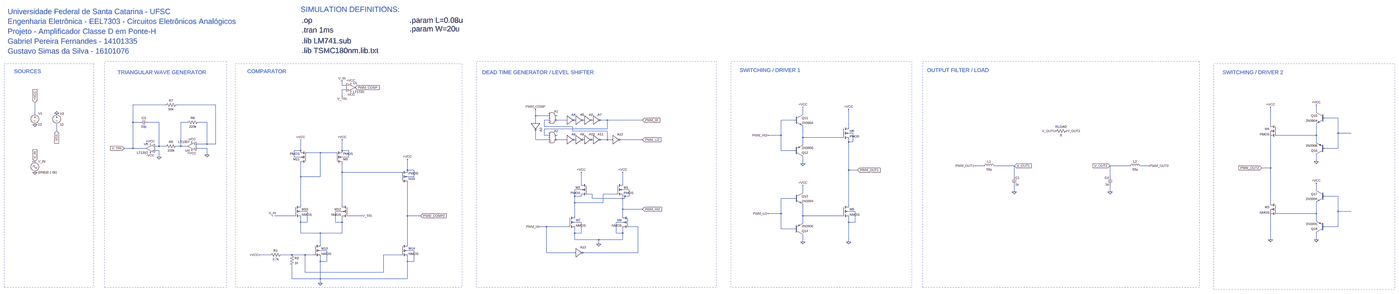
[diagram p0: schematic AmplificadorClasseD-V1.asc, whole sheet]
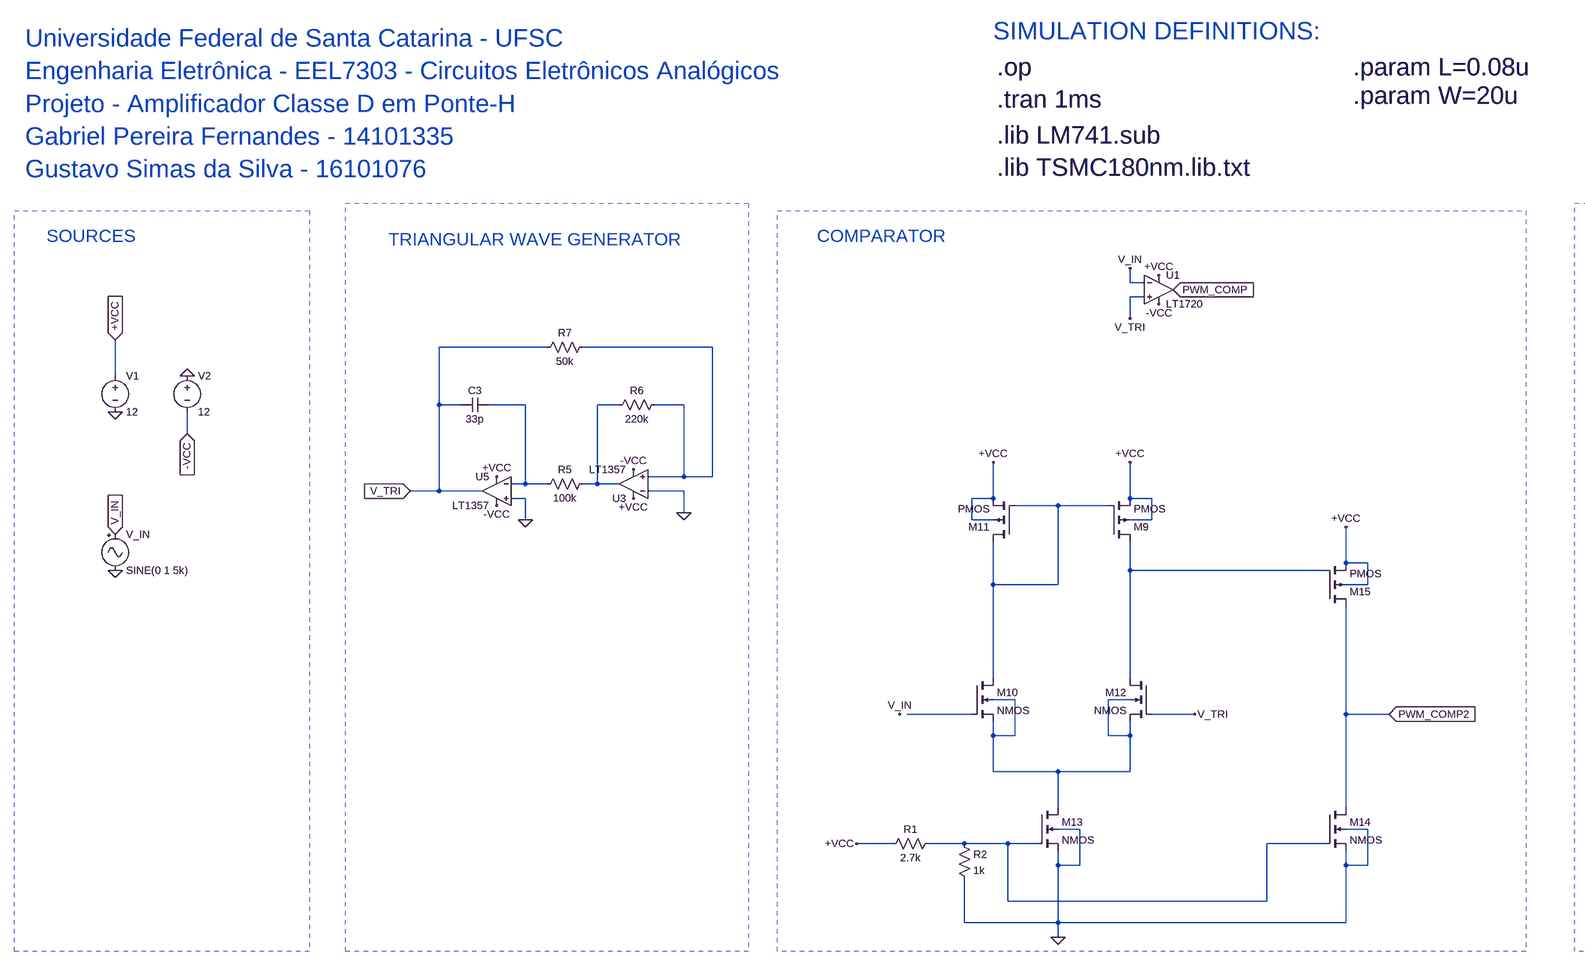
[diagram p1: schematic AmplificadorClasseD-V1.asc, part, row 1 of 1, column 1 of 3]
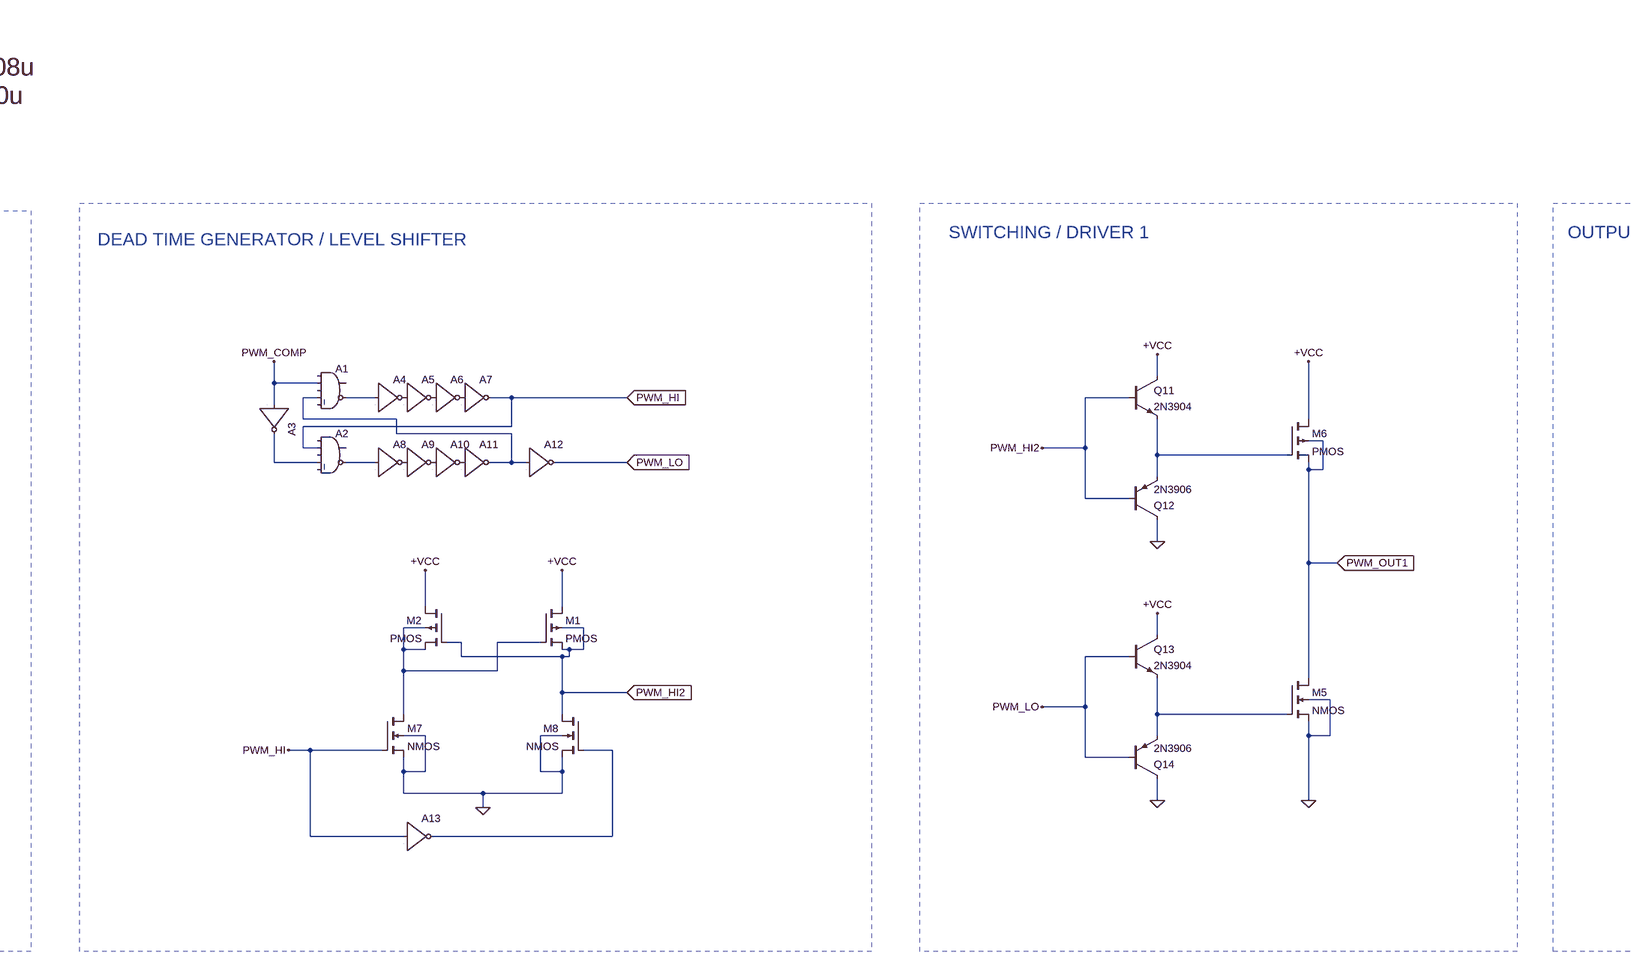
[diagram p2: schematic AmplificadorClasseD-V1.asc, part, row 1 of 1, column 2 of 3]
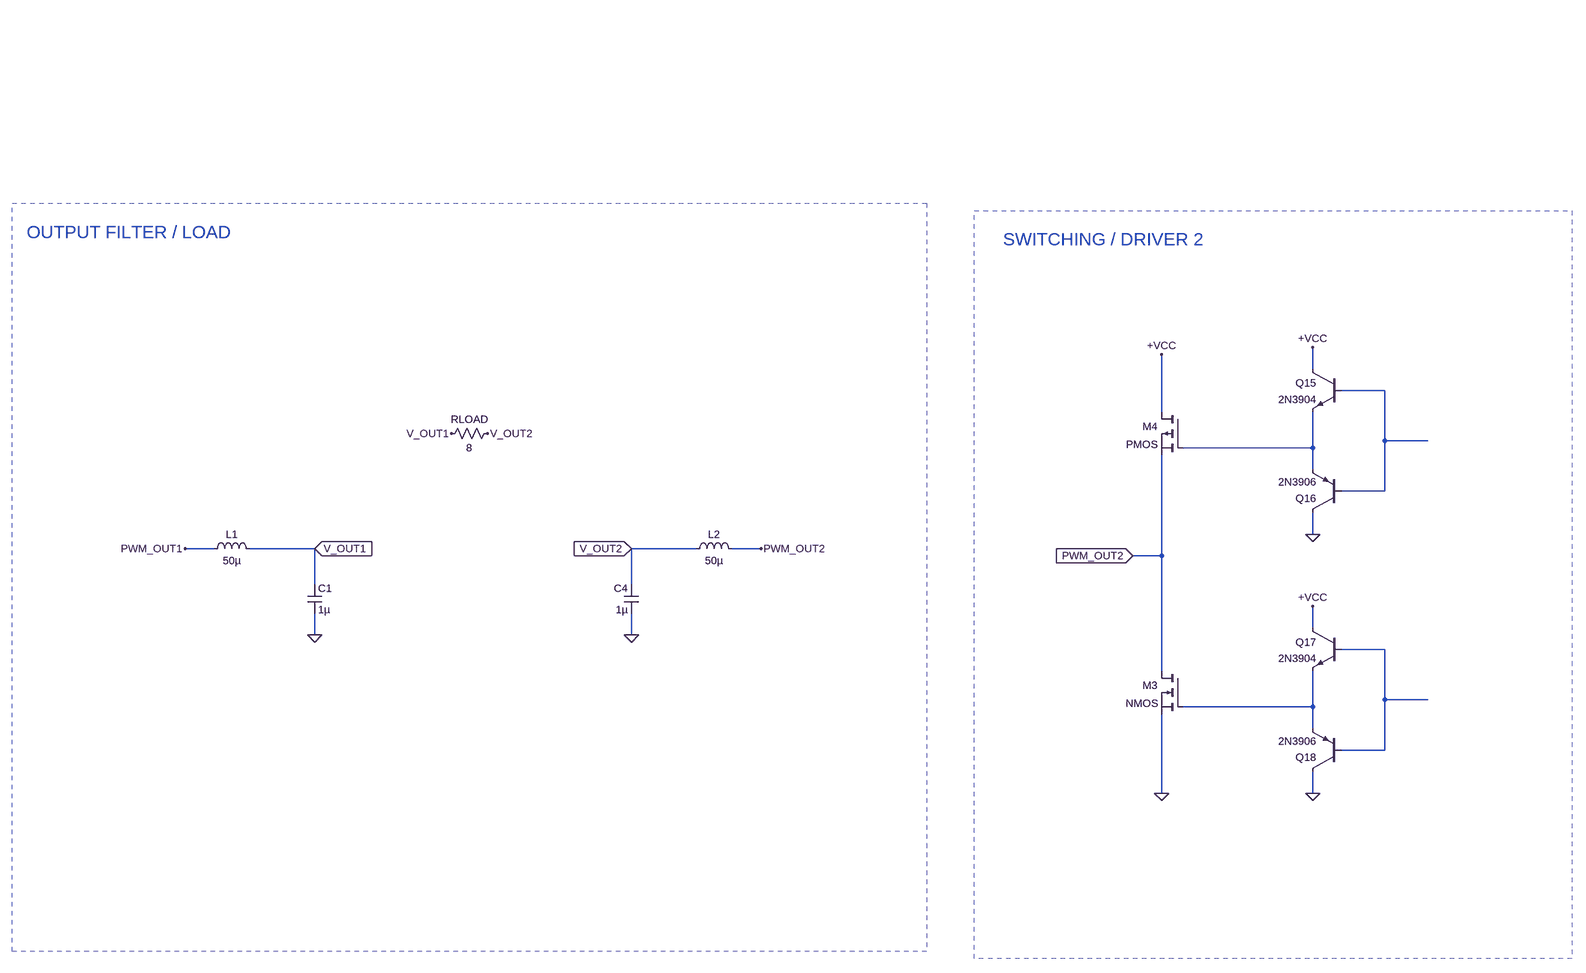
[diagram p3: schematic AmplificadorClasseD-V1.asc, part, row 1 of 1, column 3 of 3]
AmplificadorClasseD-V1.asc, the LTspice schematic file:
Version 4
SHEET 1 8820 948
WIRE 1056 -560 1056 -592
WIRE 1088 -560 1056 -560
WIRE 1088 -528 1056 -528
WIRE 1056 -480 1056 -528
WIRE -240 -416 -480 -416
WIRE 128 -416 -160 -416
WIRE 8240 -368 8240 -416
WIRE -1200 -352 -1200 -432
WIRE 4448 -352 4448 -400
WIRE 2480 -336 2480 -384
WIRE 2576 -336 2480 -336
WIRE 8400 -320 8304 -320
WIRE 2576 -304 2544 -304
WIRE 2704 -304 2640 -304
WIRE 3008 -304 2960 -304
WIRE 3264 -304 3008 -304
WIRE 4384 -304 4288 -304
WIRE -480 -288 -480 -416
WIRE -432 -288 -480 -288
WIRE -288 -288 -368 -288
WIRE -80 -288 -128 -288
WIRE 64 -288 0 -288
WIRE 2480 -288 2480 -336
WIRE 7904 -272 7904 -400
WIRE 2544 -256 2544 -304
WIRE 2752 -256 2544 -256
WIRE 4784 -256 4784 -384
WIRE 3008 -240 3008 -304
WIRE 3008 -240 2544 -240
WIRE -1040 -224 -1040 -272
WIRE 2752 -224 2752 -256
WIRE 3008 -224 2752 -224
WIRE 4816 -208 4784 -208
WIRE 8400 -208 8400 -320
WIRE 8496 -208 8400 -208
WIRE 2544 -192 2544 -240
WIRE 2576 -192 2544 -192
WIRE 4288 -192 4288 -304
WIRE 4288 -192 4192 -192
WIRE 8240 -192 8240 -272
WIRE 8240 -192 7952 -192
WIRE 4448 -176 4448 -256
WIRE 4736 -176 4448 -176
WIRE 2480 -160 2480 -224
WIRE 2576 -160 2480 -160
WIRE 2704 -160 2640 -160
WIRE 3008 -160 3008 -224
WIRE 3008 -160 2960 -160
WIRE 3040 -160 3008 -160
WIRE 3264 -160 3104 -160
WIRE 4784 -144 4784 -160
WIRE 4816 -144 4816 -208
WIRE 4816 -144 4784 -144
WIRE 8240 -144 8240 -192
WIRE 64 -128 64 -288
WIRE 64 -128 -16 -128
WIRE 128 -128 128 -416
WIRE 128 -128 64 -128
WIRE 4448 -128 4448 -176
WIRE -288 -112 -288 -288
WIRE -288 -112 -320 -112
WIRE -240 -112 -288 -112
WIRE -128 -112 -128 -288
WIRE -128 -112 -160 -112
WIRE -80 -112 -128 -112
WIRE -480 -96 -480 -288
WIRE -480 -96 -544 -96
WIRE -384 -96 -480 -96
WIRE 64 -96 -16 -96
WIRE 8400 -96 8400 -208
WIRE 8400 -96 8304 -96
WIRE -288 -80 -320 -80
WIRE 752 -80 752 -160
WIRE 752 -80 704 -80
WIRE 1056 -80 1056 -160
WIRE 1104 -80 1056 -80
WIRE 4288 -80 4288 -192
WIRE 4384 -80 4288 -80
WIRE 896 -64 800 -64
WIRE 1008 -64 896 -64
WIRE 64 -48 64 -96
WIRE -288 -32 -288 -80
WIRE 704 -32 704 -80
WIRE 752 -32 704 -32
WIRE 1104 -32 1104 -80
WIRE 1104 -32 1056 -32
WIRE 8240 0 8240 -48
WIRE 4448 16 4448 -32
WIRE 5776 32 5712 32
WIRE 6000 32 5856 32
WIRE 6848 32 6704 32
WIRE 6992 32 6928 32
WIRE 7904 48 7904 -176
WIRE 7904 48 7840 48
WIRE 1536 64 1536 -16
WIRE 1584 64 1536 64
WIRE 4784 64 4784 -144
WIRE 4848 64 4784 64
WIRE 1056 80 1056 16
WIRE 1488 80 1056 80
WIRE 752 112 752 16
WIRE 896 112 896 -64
WIRE 896 112 752 112
WIRE 1584 112 1584 64
WIRE 1584 112 1536 112
WIRE 6000 112 6000 32
WIRE 6704 112 6704 32
WIRE 2816 160 2816 80
WIRE 3120 160 3120 80
WIRE 2816 208 2768 208
WIRE 3168 208 3120 208
WIRE 8240 208 8240 160
WIRE 4448 224 4448 176
WIRE 6000 224 6000 176
WIRE 6704 224 6704 176
WIRE 2896 240 2864 240
WIRE 3072 240 2976 240
WIRE 2768 256 2768 208
WIRE 2816 256 2768 256
WIRE 3136 256 3120 256
WIRE 3168 256 3168 208
WIRE 3168 256 3136 256
WIRE 8400 256 8304 256
WIRE 2896 272 2896 240
WIRE 3120 272 2896 272
WIRE 3136 272 3136 256
WIRE 3136 272 3120 272
WIRE 4384 272 4288 272
WIRE 2768 304 2768 256
WIRE 2976 304 2976 240
WIRE 2976 304 2768 304
WIRE 7904 304 7904 48
WIRE 752 320 752 112
WIRE 1056 320 1056 80
WIRE 4784 320 4784 64
WIRE 3120 352 3120 272
WIRE 3264 352 3120 352
WIRE 800 368 752 368
WIRE 1056 368 1008 368
WIRE 4832 368 4784 368
WIRE 8400 368 8400 256
WIRE 8496 368 8400 368
WIRE 4288 384 4288 272
WIRE 4288 384 4192 384
WIRE 8240 384 8240 304
WIRE 8240 384 7952 384
WIRE 704 400 560 400
WIRE 1200 400 1104 400
WIRE 1536 400 1536 160
WIRE 1632 400 1536 400
WIRE 2768 400 2768 304
WIRE 3120 400 3120 352
WIRE 4448 400 4448 320
WIRE 4736 400 4448 400
WIRE 8240 432 8240 384
WIRE 752 448 752 416
WIRE 800 448 800 368
WIRE 800 448 752 448
WIRE 1008 448 1008 368
WIRE 1056 448 1056 416
WIRE 1056 448 1008 448
WIRE 2816 448 2768 448
WIRE 3120 448 3072 448
WIRE 4448 448 4448 400
WIRE 4784 448 4784 416
WIRE 4832 448 4832 368
WIRE 4832 448 4784 448
WIRE 2560 480 2512 480
WIRE 2720 480 2560 480
WIRE 3232 480 3168 480
WIRE 8400 480 8400 368
WIRE 8400 480 8304 480
WIRE 4288 496 4288 384
WIRE 4384 496 4288 496
WIRE 752 528 752 448
WIRE 896 528 752 528
WIRE 1056 528 1056 448
WIRE 1056 528 896 528
WIRE 2768 528 2768 496
WIRE 2816 528 2816 448
WIRE 2816 528 2768 528
WIRE 3072 528 3072 448
WIRE 3120 528 3120 496
WIRE 3120 528 3072 528
WIRE 2768 576 2768 528
WIRE 2944 576 2768 576
WIRE 3120 576 3120 528
WIRE 3120 576 2944 576
WIRE 7904 576 7904 400
WIRE 8240 576 8240 528
WIRE 4448 592 4448 544
WIRE 4784 592 4784 448
WIRE 896 608 896 528
WIRE 1536 608 1536 400
WIRE 2944 608 2944 576
WIRE 944 656 896 656
WIRE 1584 656 1536 656
WIRE 2560 672 2560 480
WIRE 2768 672 2560 672
WIRE 3232 672 3232 480
WIRE 3232 672 2832 672
WIRE 528 688 448 688
WIRE 688 688 608 688
WIRE 784 688 688 688
WIRE 848 688 784 688
WIRE 1488 688 1360 688
WIRE 896 736 896 704
WIRE 944 736 944 656
WIRE 944 736 896 736
WIRE 1536 736 1536 704
WIRE 1584 736 1584 656
WIRE 1584 736 1536 736
WIRE 784 816 784 688
WIRE 1360 816 1360 688
WIRE 1360 816 784 816
WIRE 688 864 688 768
WIRE 896 864 896 736
WIRE 896 864 688 864
WIRE 1536 864 1536 736
WIRE 1536 864 896 864
WIRE 896 896 896 864
FLAG -1200 -272 0
FLAG -1200 -432 +VCC
IOPIN -1200 -432 In
FLAG -1040 -352 0
FLAG -1040 -224 -VCC
IOPIN -1040 -224 In
FLAG -1200 80 0
FLAG -1200 0 V_IN
IOPIN -1200 0 In
FLAG 1152 -544 PWM_COMP
IOPIN 1152 -544 In
FLAG -352 -128 +VCC
FLAG -352 -64 -VCC
FLAG -288 -32 0
FLAG -48 -80 +VCC
FLAG -48 -144 -VCC
FLAG 64 -48 0
FLAG -544 -96 V_TRI
IOPIN -544 -96 In
FLAG 4784 -384 +VCC
FLAG 4448 -400 +VCC
FLAG 4448 16 0
FLAG 4784 592 0
FLAG 4448 176 +VCC
FLAG 4448 592 0
FLAG 6000 224 0
FLAG 6000 32 V_OUT1
IOPIN 6000 32 In
FLAG 4848 64 PWM_OUT1
IOPIN 4848 64 In
FLAG 5712 32 PWM_OUT1
FLAG 6704 224 0
FLAG 6704 32 V_OUT2
IOPIN 6704 32 In
FLAG 6992 32 PWM_OUT2
FLAG 7904 -400 +VCC
FLAG 8240 -416 +VCC
FLAG 8240 0 0
FLAG 7904 576 0
FLAG 8240 160 +VCC
FLAG 8240 576 0
FLAG 7840 48 PWM_OUT2
IOPIN 7840 48 In
FLAG 2480 -384 PWM_COMP
FLAG 2512 480 PWM_HI
FLAG 3264 -304 PWM_HI
IOPIN 3264 -304 In
FLAG 3264 -160 PWM_LO
IOPIN 3264 -160 In
FLAG 3264 352 PWM_HI2
IOPIN 3264 352 In
FLAG 4192 -192 PWM_HI2
FLAG 4192 384 PWM_LO
FLAG 6304 -224 V_OUT1
FLAG 6384 -224 V_OUT2
FLAG 1120 -576 +VCC
FLAG 544 400 V_IN
FLAG 1200 400 V_TRI
FLAG 2816 80 +VCC
FLAG 3120 80 +VCC
FLAG 2944 608 0
FLAG 1056 -160 +VCC
FLAG 752 -160 +VCC
FLAG 896 896 0
FLAG 1536 -16 +VCC
FLAG 448 688 +VCC
FLAG 1056 -592 V_IN
FLAG 1056 -480 V_TRI
FLAG 1120 -512 -VCC
FLAG 1632 400 PWM_COMP2
IOPIN 1632 400 In
SYMBOL voltage -1200 -368 R0
WINDOW 123 0 0 Left 0
WINDOW 39 0 0 Left 0
SYMATTR InstName V1
SYMATTR Value 12
SYMBOL voltage -1040 -368 R0
WINDOW 123 0 0 Left 0
WINDOW 39 0 0 Left 0
SYMATTR InstName V2
SYMATTR Value 12
SYMBOL Misc\\signal -1200 -16 R0
WINDOW 123 0 0 Left 0
WINDOW 39 0 0 Left 0
SYMATTR InstName V_IN
SYMATTR Value SINE(0 1 5k)
SYMBOL Opamps\\LT1357 -352 -160 M0
SYMATTR InstName U5
SYMBOL res -144 -128 R90
WINDOW 0 0 56 VBottom 2
WINDOW 3 32 56 VTop 2
SYMATTR InstName R5
SYMATTR Value 100k
SYMBOL Opamps\\LT1357 -48 -48 R180
SYMATTR InstName U3
SYMBOL cap -368 -304 R90
WINDOW 0 0 32 VBottom 2
WINDOW 3 32 32 VTop 2
SYMATTR InstName C3
SYMATTR Value 33p
SYMBOL res 16 -304 R90
WINDOW 0 0 56 VBottom 2
WINDOW 3 32 56 VTop 2
SYMATTR InstName R6
SYMATTR Value 220k
SYMBOL res -144 -432 R90
WINDOW 0 0 56 VBottom 2
WINDOW 3 32 56 VTop 2
SYMATTR InstName R7
SYMATTR Value 50k
SYMBOL npn 4384 -352 R0
SYMATTR InstName Q11
SYMATTR Value 2N3904
SYMBOL pnp 4384 -32 M180
SYMATTR InstName Q12
SYMATTR Value 2N3906
SYMBOL npn 4384 224 R0
SYMATTR InstName Q13
SYMATTR Value 2N3904
SYMBOL pnp 4384 544 M180
SYMATTR InstName Q14
SYMATTR Value 2N3906
SYMBOL ind 5760 48 R270
WINDOW 0 32 56 VTop 2
WINDOW 3 5 56 VBottom 2
SYMATTR InstName L1
SYMATTR Value 50µ
SYMBOL cap 5984 112 R0
SYMATTR InstName C1
SYMATTR Value 1µ
SYMBOL res 6400 -240 R90
WINDOW 0 0 56 VBottom 2
WINDOW 3 32 56 VTop 2
SYMATTR InstName RLOAD
SYMATTR Value 8
SYMBOL ind 6944 48 M270
WINDOW 0 32 56 VTop 2
WINDOW 3 5 56 VBottom 2
SYMATTR InstName L2
SYMATTR Value 50µ
SYMBOL cap 6720 112 M0
SYMATTR InstName C4
SYMATTR Value 1µ
SYMBOL nmos 7952 304 M0
SYMATTR InstName M3
SYMBOL pmos 7952 -272 M0
SYMATTR InstName M4
SYMBOL npn 8304 -368 M0
SYMATTR InstName Q15
SYMATTR Value 2N3904
SYMBOL pnp 8304 -48 R180
SYMATTR InstName Q16
SYMATTR Value 2N3906
SYMBOL npn 8304 208 M0
SYMATTR InstName Q17
SYMATTR Value 2N3904
SYMBOL pnp 8304 528 R180
SYMATTR InstName Q18
SYMATTR Value 2N3906
SYMBOL Digital\\and 2608 -384 R0
SYMATTR InstName A1
SYMBOL Digital\\and 2608 -240 R0
SYMATTR InstName A2
SYMBOL Digital\\inv 2544 -288 R90
SYMATTR InstName A3
SYMBOL Digital\\inv 2704 -368 R0
SYMATTR InstName A4
SYMBOL Digital\\inv 2768 -368 R0
SYMATTR InstName A5
SYMBOL Digital\\inv 2832 -368 R0
SYMATTR InstName A6
SYMBOL Digital\\inv 2896 -368 R0
SYMATTR InstName A7
SYMBOL Digital\\inv 2704 -224 R0
SYMATTR InstName A8
SYMBOL Digital\\inv 2768 -224 R0
SYMATTR InstName A9
SYMBOL Digital\\inv 2832 -224 R0
SYMATTR InstName A10
SYMBOL Digital\\inv 2896 -224 R0
SYMATTR InstName A11
SYMBOL Digital\\inv 3040 -224 R0
SYMATTR InstName A12
SYMBOL nmos4 4736 320 R0
SYMATTR InstName M5
SYMATTR Value2 l=0.9u w=1.8u
SYMBOL pmos4 4736 -256 R0
SYMATTR InstName M6
SYMATTR Value2 l=0.9u w=1.8u
SYMBOL Comparators\\LT1720 1120 -608 R0
SYMATTR InstName U1
SYMBOL pmos4 3072 160 R0
SYMATTR InstName M1
SYMATTR Value2 l={L} w={W}
SYMBOL pmos4 2864 160 M0
SYMATTR InstName M2
SYMATTR Value2 l={L} w={W}
SYMBOL nmos4 2720 400 R0
SYMATTR InstName M7
SYMATTR Value2 l={L} w={W}
SYMBOL nmos4 3168 400 M0
SYMATTR InstName M8
SYMATTR Value2 l={L} w={W}
SYMBOL Digital\\inv 2768 608 R0
SYMATTR InstName A13
SYMBOL pmos4 1008 16 M180
SYMATTR InstName M9
SYMATTR Value2 l={L} w={W}
SYMBOL nmos4 704 320 R0
SYMATTR InstName M10
SYMATTR Value2 l={L} w={W}
SYMBOL pmos4 800 16 R180
SYMATTR InstName M11
SYMATTR Value2 l={L} w={W}
SYMBOL nmos4 1104 320 M0
SYMATTR InstName M12
SYMATTR Value2 l={L} w={W}
SYMBOL nmos4 848 608 R0
SYMATTR InstName M13
SYMATTR Value2 l={L} w={W}
SYMBOL nmos4 1488 608 R0
SYMATTR InstName M14
SYMATTR Value2 l={L} w={W}
SYMBOL pmos4 1488 160 M180
SYMATTR InstName M15
SYMATTR Value2 l={L} w={W}
SYMBOL res 624 672 R90
WINDOW 0 0 56 VBottom 2
WINDOW 3 32 56 VTop 2
SYMATTR InstName R1
SYMATTR Value 2.7k
SYMBOL res 672 672 R0
SYMATTR InstName R2
SYMATTR Value 1k
TEXT 760 -968 Left 5 !.tran 1ms
TEXT 760 -888 Left 5 !.lib LM741.sub
TEXT -1400 -1104 Left 5 ;Universidade Federal de Santa Catarina - UFSC\nEngenharia Eletrônica - EEL7303 - Circuitos Eletrônicos Analógicos\nProjeto - Amplificador Classe D em Ponte-H\nGabriel Pereira Fernandes - 14101335\nGustavo Simas da Silva - 16101076
TEXT 752 -1120 Left 5 ;SIMULATION DEFINITIONS:
TEXT 760 -1040 Left 5 !.op
TEXT -1352 -664 Left 4 ;SOURCES
TEXT -592 -656 Left 4 ;TRIANGULAR WAVE GENERATOR
TEXT 360 -664 Left 4 ;COMPARATOR
TEXT 2088 -656 Left 4 ;DEAD TIME GENERATOR / LEVEL SHIFTER
TEXT 3984 -672 Left 4 ;SWITCHING / DRIVER 1
TEXT 5360 -672 Left 4 ;OUTPUT FILTER / LOAD
TEXT 7552 -656 Left 4 ;SWITCHING / DRIVER 2
TEXT 760 -816 Left 5 !.lib TSMC180nm.lib.txt
TEXT 1552 -1040 Left 5 !.param L=0.08u
TEXT 1552 -976 Left 5 !.param W=20u
RECTANGLE Normal -768 928 -1424 -720 2
RECTANGLE Normal 1936 928 272 -720 2
RECTANGLE Normal 3808 928 2048 -736 2
RECTANGLE Normal 5248 928 3920 -736 2
RECTANGLE Normal 7360 928 5328 -736 2
RECTANGLE Normal 8816 944 7488 -720 2
RECTANGLE Normal 208 928 -688 -736 2

The netlist it stands for:
* AmplificadorClasseD-V1.asc
V1 +VCC 0 12
V2 0 -VCC 12
V_IN V_IN 0 SINE(0 1 5k)
XU5 0 N005 +VCC -VCC V_TRI LT1357  ; pins In+ In- V+ V- OUT
R5 N006 N005 100k
XU3 N001 0 +VCC -VCC N006 LT1357  ; pins In+ In- V+ V- OUT
C3 N005 V_TRI 33p
R6 N001 N006 220k
R7 N001 V_TRI 50k
Q11 +VCC PWM_HI2 N008 0 2N3904
Q12 0 PWM_HI2 N008 0 2N3906
Q13 +VCC PWM_LO N018 0 2N3904
Q14 0 PWM_LO N018 0 2N3906
L1 PWM_OUT1 V_OUT1 50µ
C1 V_OUT1 0 1µ
RLOAD V_OUT2 V_OUT1 8
L2 PWM_OUT2 V_OUT2 50µ
C4 V_OUT2 0 1µ
M3 PWM_OUT2 N016 0 0 NMOS
M4 +VCC N007 PWM_OUT2 PWM_OUT2 PMOS
Q15 +VCC N002 N007 0 2N3904
Q16 0 N002 N007 0 2N3906
Q17 +VCC N014 N016 0 2N3904
Q18 0 N014 N016 0 2N3906
A1 0 PWM_COMP 0 N003 0 N004 0 0 AND
A2 0 PWM_HI 0 N009 0 N010 0 0 AND
A3 PWM_COMP 0 0 0 0 N009 0 0 BUF
A4 N004 0 0 0 0 P001 0 0 BUF
A5 P001 0 0 0 0 P002 0 0 BUF
A6 P002 0 0 0 0 P003 0 0 BUF
A7 P003 0 0 0 0 PWM_HI 0 0 BUF
A8 N010 0 0 0 0 P004 0 0 BUF
A9 P004 0 0 0 0 P005 0 0 BUF
A10 P005 0 0 0 0 P006 0 0 BUF
A11 P006 0 0 0 0 N003 0 0 BUF
A12 N003 0 0 0 0 PWM_LO 0 0 BUF
M5 PWM_OUT1 N018 0 0 NMOS l=0.9u w=1.8u
M6 +VCC N008 PWM_OUT1 PWM_OUT1 PMOS l=0.9u w=1.8u
XU1 V_TRI V_IN +VCC -VCC PWM_COMP LT1720  ; pins In+ In- V+ V- OUT
M1 +VCC N013 PWM_HI2 PWM_HI2 PMOS l={L} w={W}
M2 +VCC PWM_HI2 N013 N013 PMOS l={L} w={W}
M7 N013 PWM_HI 0 0 NMOS l={L} w={W}
M8 PWM_HI2 N019 0 0 NMOS l={L} w={W}
A13 PWM_HI 0 0 0 0 N019 0 0 BUF
M9 N012 N011 +VCC +VCC PMOS l={L} w={W}
M10 N011 N017 N015 N015 NMOS l={L} w={W}
M11 N011 N011 +VCC +VCC PMOS l={L} w={W}
M12 N012 V_TRI N015 N015 NMOS l={L} w={W}
M13 N015 N020 0 0 NMOS l={L} w={W}
M14 PWM_COMP2 N020 0 0 NMOS l={L} w={W}
M15 PWM_COMP2 N012 +VCC +VCC PMOS l={L} w={W}
R1 N020 +VCC 2.7k
R2 N020 0 1k
.model NPN NPN
.model PNP PNP
.lib standard.bjt
.model NMOS NMOS
.model PMOS PMOS
.lib standard.mos
.tran 1ms
.lib LM741.sub
* Universidade Federal de Santa Catarina - UFSC
* Engenharia Eletrônica - EEL7303 - Circuitos Eletrônicos Analógicos
* Projeto - Amplificador Classe D em Ponte-H
* Gabriel Pereira Fernandes - 14101335
* Gustavo Simas da Silva - 16101076
* SIMULATION DEFINITIONS:
.op
* SOURCES
* TRIANGULAR WAVE GENERATOR
* COMPARATOR
* DEAD TIME GENERATOR / LEVEL SHIFTER
* SWITCHING / DRIVER 1
* OUTPUT FILTER / LOAD
* SWITCHING / DRIVER 2
.lib TSMC180nm.lib.txt
.param L=0.08u
.param W=20u
.lib LT1720.sub
.backanno
.end